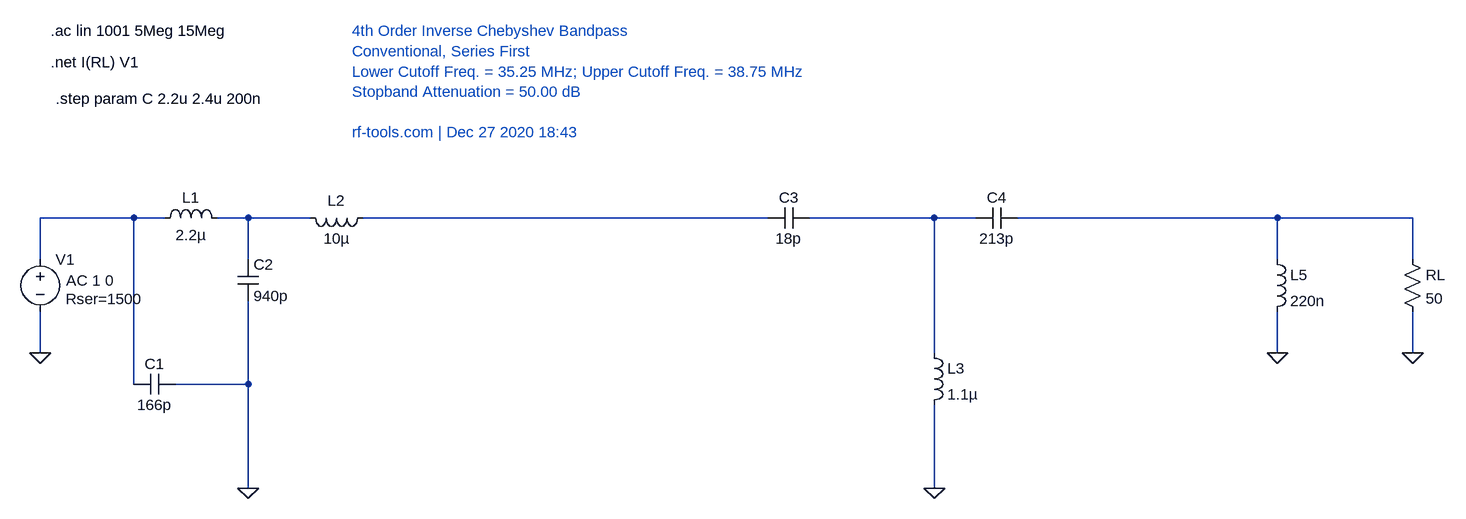
[diagram p0: schematic if3_filter.asc]
if3_filter.asc, the LTspice schematic file:
Version 4
SHEET 1 2164 436
WIRE 144 0 0 0
WIRE 192 0 144 0
WIRE 320 0 272 0
WIRE 416 0 320 0
WIRE 1120 0 496 0
WIRE 1376 0 1184 0
WIRE 1440 0 1376 0
WIRE 1904 0 1504 0
WIRE 2112 0 1904 0
WIRE 0 64 0 0
WIRE 320 64 320 0
WIRE 1904 64 1904 0
WIRE 2112 64 2112 0
WIRE 0 208 0 144
WIRE 1376 208 1376 0
WIRE 1904 208 1904 144
WIRE 2112 208 2112 144
WIRE 144 256 144 0
WIRE 320 256 320 128
WIRE 320 256 208 256
WIRE 320 416 320 256
WIRE 1376 416 1376 288
FLAG 0 208 0
FLAG 320 416 0
FLAG 1376 416 0
FLAG 1904 208 0
FLAG 2112 208 0
SYMBOL voltage 0 48 R0
WINDOW 123 40 48 Left 2
WINDOW 39 39 77 Left 2
SYMATTR Value2 AC 1 0
SYMATTR SpiceLine Rser=1500
SYMATTR InstName V1
SYMATTR Value ""
SYMBOL cap 144 272 R270
WINDOW 0 32 32 VTop 2
WINDOW 3 0 32 VBottom 2
SYMATTR InstName C1
SYMATTR Value 166p
SYMBOL ind 176 16 R270
WINDOW 0 32 56 VTop 2
WINDOW 3 5 56 VBottom 2
SYMATTR InstName L1
SYMATTR Value 2.2µ
SYMBOL cap 304 64 R0
SYMATTR InstName C2
SYMATTR Value 940p
SYMBOL ind 1360 192 R0
SYMATTR InstName L3
SYMATTR Value 1.1µ
SYMBOL cap 1440 16 R270
WINDOW 0 32 32 VTop 2
WINDOW 3 0 32 VBottom 2
SYMATTR InstName C4
SYMATTR Value 213p
SYMBOL ind 1888 48 R0
SYMATTR InstName L5
SYMATTR Value 220n
SYMBOL res 2096 48 R0
SYMATTR InstName RL
SYMATTR Value 50
SYMBOL ind 512 -16 R90
WINDOW 0 5 56 VBottom 2
WINDOW 3 32 56 VTop 2
SYMATTR InstName L2
SYMATTR Value 10µ
SYMBOL cap 1184 -16 R90
WINDOW 0 0 32 VBottom 2
WINDOW 3 32 32 VTop 2
SYMATTR InstName C3
SYMATTR Value 18p
TEXT 16 -288 Left 2 !.ac lin 1001 5Meg 15Meg
TEXT 16 -240 Left 2 !.net I(RL) V1
TEXT 480 -288 Left 2 ;4th Order Inverse Chebyshev Bandpass\nConventional, Series First\nLower Cutoff Freq. = 35.25 MHz; Upper Cutoff Freq. = 38.75 MHz\nStopband Attenuation = 50.00 dB\n\nrf-tools.com | Dec 27 2020 18:43
TEXT 24 -184 Left 2 !.step param C 2.2u 2.4u 200n

The netlist it stands for:
* if3_filter.asc
V1 N001 0 AC 1 0 Rser=1500
C1 N001 0 166p
L1 N001 N002 2.2µ
C2 N002 0 940p
L3 N004 0 1.1µ
C4 N004 N005 213p
L5 N005 0 220n
RL N005 0 50
L2 N003 N002 10µ
C3 N004 N003 18p
.ac lin 1001 5Meg 15Meg
.net I(RL) V1
* 4th Order Inverse Chebyshev Bandpass
* Conventional, Series First
* Lower Cutoff Freq. = 35.25 MHz; Upper Cutoff Freq. = 38.75 MHz
* Stopband Attenuation = 50.00 dB
* rf-tools.com | Dec 27 2020 18:43
.step param C 2.2u 2.4u 200n
.backanno
.end